# Altium schematic sheet HLK-V20-KIT-V2.1.SCHDOC
size A4
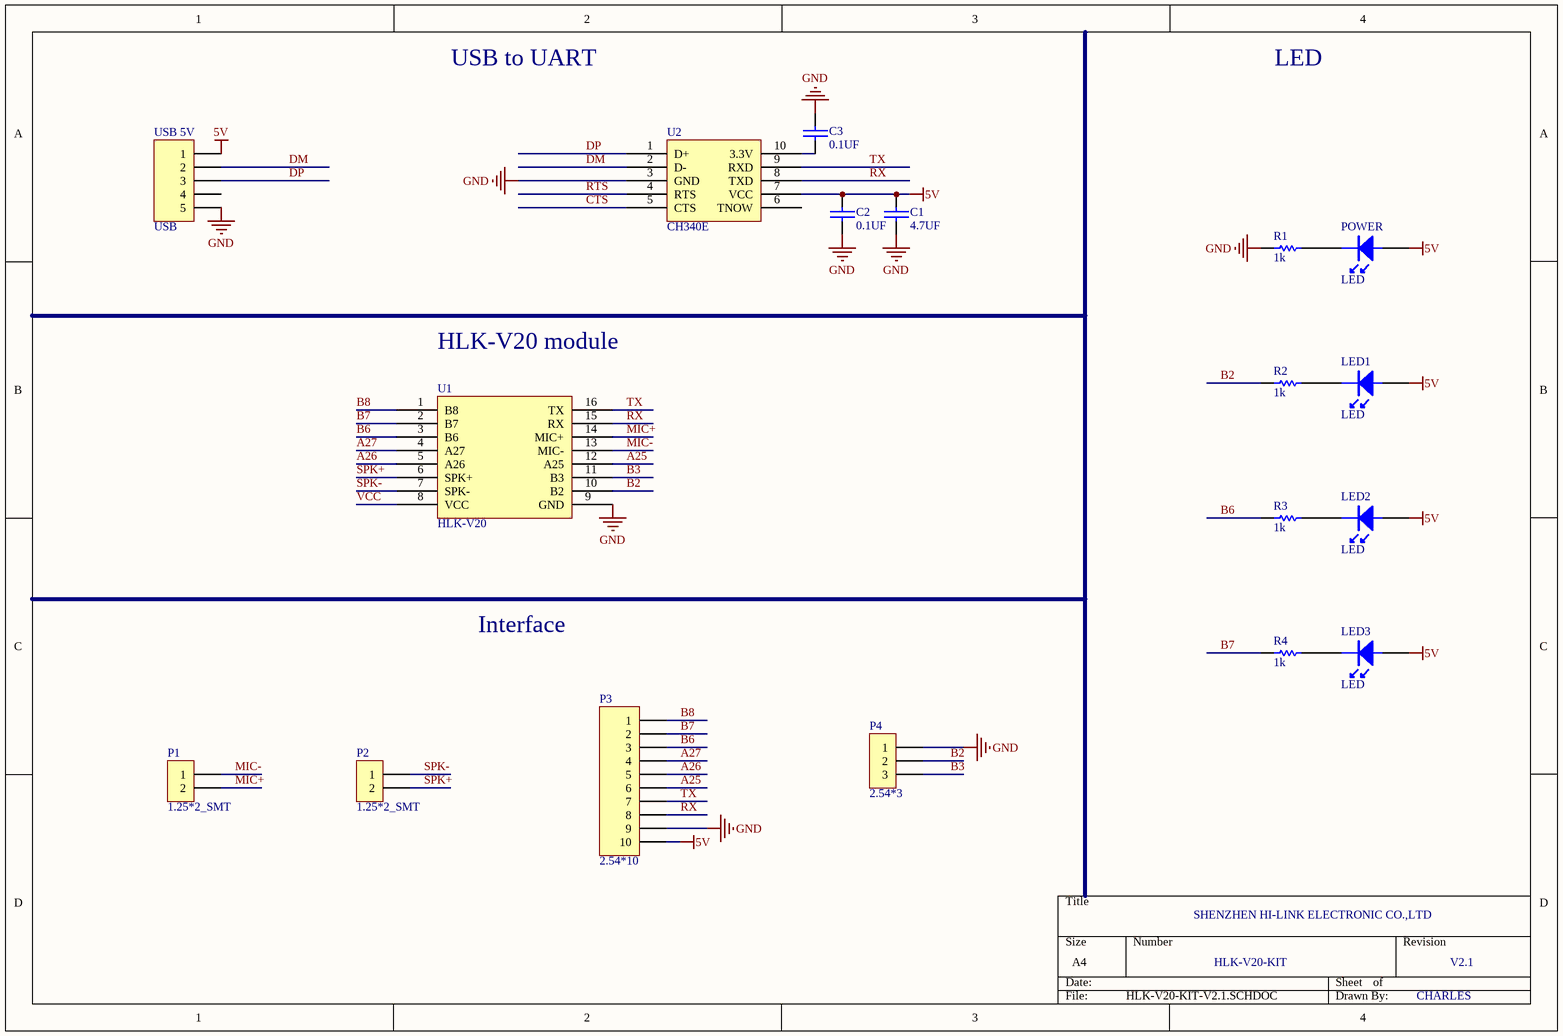
[diagram p0: HLK-V20-KIT-V2.1.SCHDOC]

## Parts
C1  4.7UF
C2  0.1UF
C3  0.1UF
LED1  LED  [0603LED]
LED2  LED  [0603LED]
LED3  LED  [0603LED]
P1  1.25*2_SMT
P2  1.25*2_SMT
P3  2.54*10  [HDR1X10]
P4  2.54*3
POWER  LED  [0603LED]
R1  value 1k  [0603]  (hidden comment: Res1)
R2  value 1k  [0603]  (hidden comment: Res1)
R3  value 1k  [0603]  (hidden comment: Res1)
R4  value 1k  [0603]  (hidden comment: Res1)
U1  HLK-V20  [HLK-V20]
U2  CH340E  [MSOP-10]
USB_5V  USB  [MICRO_USB]

## Nets
5V: C1.2 C2.2 LED1.1 LED2.1 LED3.1 P3.10 POWER.1 U2.7(VCC) USB_5V.1
GND: C1.1 C2.1 C3.1 P3.9 P4.1 R1.2 U1.9(GND) U2.3(GND) USB_5V.5
A25: P3.6 U1.12(A25)
A26: P3.5 U1.5(A26)
A27: P3.4 U1.4(A27)
B2: P4.2 R2.2 U1.10(B2)
B3: P4.3 U1.11(B3)
B6: P3.3 R3.2 U1.3(B6)
B7: P3.2 R4.2 U1.2(B7)
B8: P3.1 U1.1(B8)
CTS: U2.5(CTS)
DM: U2.2(D-) USB_5V.2
DP: U2.1(D+) USB_5V.3
MIC+: P1.2 U1.14(MIC+)
MIC-: P1.1 U1.13(MIC-)
RTS: U2.4(RTS)
RX: P3.8 U1.15(RX) U2.8(TXD)
SPK+: P2.2 U1.6(SPK+)
SPK-: P2.1 U1.7(SPK-)
TX: P3.7 U1.16(TX) U2.9(RXD)
VCC: U1.8(VCC)
NetC3_2: C3.2 U2.10(3.3V)
NetLED1_2: LED1.2 R2.1
NetLED2_2: LED2.2 R3.1
NetLED3_2: LED3.2 R4.1
NetPOWER_2: POWER.2 R1.1

Not connected (* = marked no-connect by the designer): U2 6(TNOW); USB_5V 4

## Notes on the sheet
- USB to UART
- LED
- HLK-V20 module
- Interface
- SHENZHEN HI-LINK ELECTRONIC CO.,LTD
- HLK-V20-KIT
- V2.1
- CHARLES

## Library data of the parts
C1-C3 = CAP: Capacitor
P1 P2 = CON2: Connector
P3 = Header 10: Header, 10-Pin; LatestRevisionDate: 17-Jul-2002; LatestRevisionNote: Re-released for DXP Platform.; Publisher: Altium Limited
P4 = CON3: Connector
R1-R4 = Res1: Resistor; Published: 8-Jun-2000; LatestRevisionDate: 17-Jul-2002; LatestRevisionNote: Re-released for DXP Platform.; PackageReference: AXIAL-0.3; Publisher: Altium Limited
U1 = HLK-V20: HLK-V20语音模块
USB_5V = Header 5: Header, 5-Pin; LatestRevisionDate: 17-Jul-2002; LatestRevisionNote: Re-released for DXP Platform.; Publisher: Altium Limited